# EAGLE design mpx4115-breakout-throughhole (EAGLE 6.5.0)
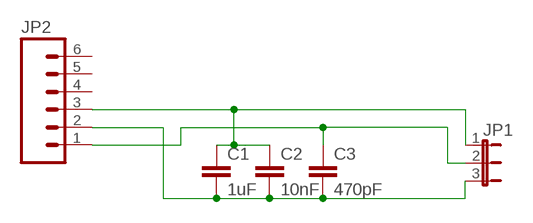
[diagram p0: schematic, sheet 1]

## Parts
C1  1uF  C-EUC0805  [C0805]
C2  10nF  C-EUC0805  [C0805]
C3  470pF  C-EUC0805  [C0805]
JP1  JP2E  [JP2]
JP2  M06NO_SILK  [1X06_NO_SILK]

## Nets
GND: C1.2 C2.2 C3.2 JP2.2
N$3: JP1.3
VCC: C1.1 C2.1 JP1.1 JP2.3
VOUT: C3.1 JP1.2 JP2.1
Unconnected: JP2.4 JP2.5 JP2.6

## Library data of the parts
C1-C3 = resistor:C-EU: CAPACITOR, European symbol
JP1 = jumper:JP2E: JUMPER
JP2 = SparkFun-Connectors:M06: Header 6 Standard 6-pin 0.1" header. Use with straight break away headers (SKU : PRT-00116), right angle break away headers (PRT-00553), swiss pins (PRT-00743), machine pins (PRT-00117), and female headers (PRT-00115). Molex polarized connector foot print use with SKU : PRT-08094 with associated crimp pins and housings. NOTES ON THE VARIANTS LOCK and LOCK_LONGPADS... This footprint was designed to help hold the alignment of a through-hole component (i.e. 6-pin header) while soldering it into place. You may notice that each hole has been shifted either up or down by 0.005 of an inch from it's more standard position (which is a perfectly straight line). This slight alteration caused the pins (the squares in the middle) to touch the edges of the holes. Because they are alternating, it causes a "brace" to hold the component in place. 0.005 has proven to be the perfect amount of "off-center" position when using our standard breakaway headers. Although looks a little odd when you look at the bare footprint, once you have a header in there, the alteration is very hard to notice. Also,if you push a header all the way into place, it is covered up entirely on the bottom side. This idea of altering the position of holes to aid alignment will be further integrated into the Sparkfun Library for other footprints. It can help hold any component with 3 or more connection pins.

## Board
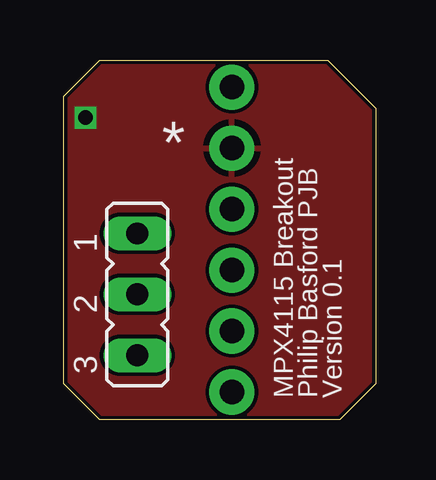
[diagram p1: board, top side]
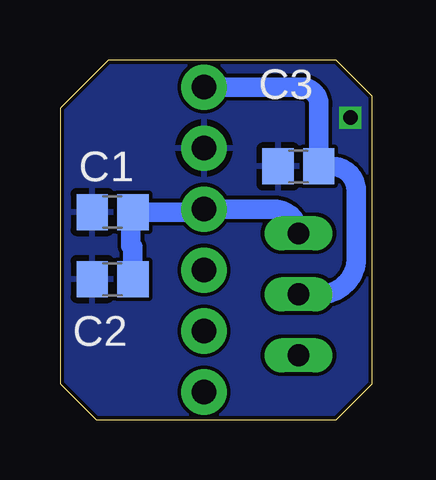
[diagram p2: board, bottom side, seen from below]

Size 13 x 15 mm. Coordinates in mm from the lower left corner, seen from the top.
Outline: 1.5,15 11,15 13,13 13,1.5 11.5,0 1.5,0 0,1.5 0,13.5 1.5,15
Copper layers (1*16): Top 0.035mm / dielectric 1.5mm / Bottom 0.035mm
Design rules "Hackvana": minimum track width 6mil, minimum drill 0.3mm, track to track 6mil, track to pad 6mil, pad to pad 6mil, via to via 6mil, smd to smd 0mil, copper to edge 6mil, drill to drill 6mil, minimum pad ring 10mil, minimum via ring 6mil, stop-mask expansion 2mil, vias tented up to drill 100mil, thermal gap 10mil

### Footprints (pad centres in the part's own frame; a part is rotated, then mirrored left to right if it is on the bottom)
C0805 = smd 1.3 x 1.5: 1 -0.85,0; 2 0.85,0
JP2 = drill 0.914 long: 1 -2.54,0; 2 0,0; 3 2.54,0
1X06_NO_SILK = drill 1.016 pad 1.88: 1 0,0; 2 2.54,0; 3 5.08,0; 4 7.62,0; 5 10.16,0; 6 12.7,0

### Placement (x,y rotation side)
C1  10.81,8.66 180 bottom
C2  10.81,5.87 180 bottom
C3  3.06,10.56 180 bottom
JP1  3.06,5.23 270 top
JP2  7,13.87 270 top

### Tracks (layer width: path | path; a pad name or v marks a point on that pad's centre or on a via)
GND  (via drill 0.6)
  other vias: 0.9,12.6
  pour Bottom: 0.9,16.15 11.83,16.15 14.62,13.36 14.62,0.66 12.33,-1.63 0.9,-1.63 -1.13,0.4 -1.13,14.12
  pour Top: 1.41,15.64 11.32,15.62 13.86,13.1 13.86,1.17 11.83,-0.87 1.16,-0.87 -0.62,0.91 -0.62,13.61
VCC
  Bottom 0.813: C2.1 9.96,7.17 arc-90 10.05,7.26 10.05,8.57 arc90 C1.1 7.13,8.66 arc-90 JP2.3 4.08,8.79 arc90 JP1.1
VOUT
  Bottom 0.813: JP1.2 2.17,5.23 arc-90 0.65,6.75 0.65,9.55 arc-90 1.67,10.56 C3.1 2.21,13.14 arc-90 2.94,13.87 6.24,13.87 arc-90 JP2.1

### Text on the board
tNames: * | MPX4115 Breakout | Philip Basford PJB | Version 0.1